# EAGLE design RSL_Satellite (EAGLE 6.4)
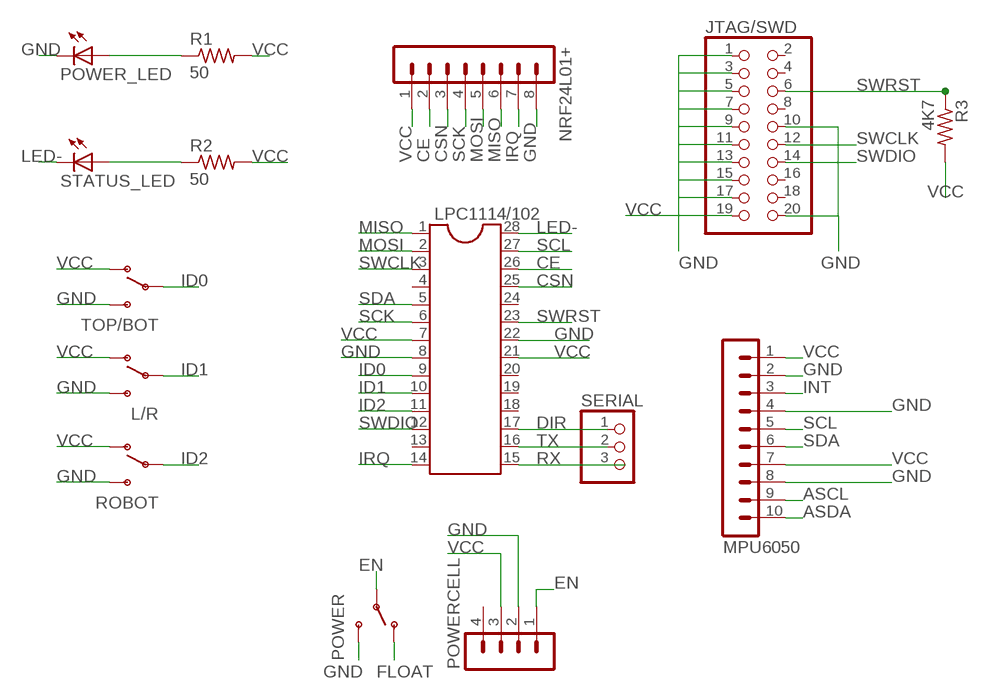
[diagram p0: schematic, sheet 1]

## Parts
JTAG/SWD  PINHD-2X10  [2X10]
L/R  SWITCH-SPDTPTH  [SWITCH-SPDT]
LPC1114/102  DIL28  [DIL28-6]
MPU6050  MA10-1  [MA10-1]
NRF24L01+  MA08-1  [MA08-1]
POWER  SWITCH-SPDTPTH  [SWITCH-SPDT]
POWER_LED  LED5MM  [LED5MM]
POWERCELL  MA04-1  [MA04-1]
R1  50  R-US_0207/10  [0207/10]
R2  50  R-US_0207/10  [0207/10]
R3  4K7  R-US_0207/10  [0207/10]
ROBOT  SWITCH-SPDTPTH  [SWITCH-SPDT]
SERIAL  PINHD-1X3  [1X03]
STATUS_LED  LED5MM  [LED5MM]
TOP/BOT  SWITCH-SPDTPTH  [SWITCH-SPDT]

## Nets
ASCL: MPU6050.9
ASDA: MPU6050.10
CE: LPC1114/102.26 NRF24L01+.2
CSN: LPC1114/102.25 NRF24L01+.3
DIR: LPC1114/102.17 SERIAL.1
EN: POWER.2(P) POWERCELL.1
FLOAT: POWER.1(O)
GND: JTAG/SWD.1 JTAG/SWD.3 JTAG/SWD.5 JTAG/SWD.7 JTAG/SWD.9 JTAG/SWD.10 JTAG/SWD.11 JTAG/SWD.13 JTAG/SWD.15 JTAG/SWD.17 JTAG/SWD.20 L/R.3(S) LPC1114/102.8 LPC1114/102.22 MPU6050.2 MPU6050.4 MPU6050.8 NRF24L01+.8 POWER.3(S) POWER_LED.K(C) POWERCELL.2 ROBOT.3(S) TOP/BOT.3(S)
ID0: LPC1114/102.9 TOP/BOT.2(P)
ID1: L/R.2(P) LPC1114/102.10
ID2: LPC1114/102.11 ROBOT.2(P)
INT: MPU6050.3
IRQ: LPC1114/102.14 NRF24L01+.7
LED-: LPC1114/102.28 STATUS_LED.K(C)
MISO: LPC1114/102.1 NRF24L01+.6
MOSI: LPC1114/102.2 NRF24L01+.5
N$1: POWER_LED.A R1.1
N$2: R2.1 STATUS_LED.A
RX: LPC1114/102.15 SERIAL.3
SCK: LPC1114/102.6 NRF24L01+.4
SCL: LPC1114/102.27 MPU6050.5
SDA: LPC1114/102.5 MPU6050.6
SWCLK: JTAG/SWD.12 LPC1114/102.3
SWDIO: JTAG/SWD.14 LPC1114/102.12
SWRST: JTAG/SWD.6 LPC1114/102.23 R3.1
TX: LPC1114/102.16 SERIAL.2
VCC: JTAG/SWD.19 L/R.1(O) LPC1114/102.7 LPC1114/102.21 MPU6050.1 MPU6050.7 NRF24L01+.1 POWERCELL.3 R1.2 R2.2 R3.2 ROBOT.1(O) TOP/BOT.1(O)
Unconnected: JTAG/SWD.2 JTAG/SWD.4 JTAG/SWD.8 JTAG/SWD.16 JTAG/SWD.18 LPC1114/102.4 LPC1114/102.13 LPC1114/102.18 LPC1114/102.19 LPC1114/102.20 LPC1114/102.24 POWERCELL.4

## Library data of the parts
JTAG/SWD = pinhead:PINHD-2X10: PIN HEADER
L/R POWER ROBOT TOP/BOT = SparkFun-Electromechanical:SWITCH-SPDT: SPDT Switch Simple slide switch, Spark Fun Electronics SKU : COM-00102 DPDT SMT slide switch, AYZ0202, SWCH-08179
LPC1114/102 = ic-package:DIL28: Dual In Line
MPU6050 = con-lstb:MA10-1: PIN HEADER
NRF24L01+ = con-lstb:MA08-1: PIN HEADER
POWER_LED STATUS_LED = led:LED: LED OSRAM: - CHIPLED LG R971, LG N971, LY N971, LG Q971, LY Q971, LO R971, LY R971 LH N974, LH R974 LS Q976, LO Q976, LY Q976 LO Q996 - Hyper CHIPLED LW Q18S LB Q993, LB Q99A, LB R99A - SideLED LS A670, LO A670, LY A670, LG A670, LP A670 LB A673, LV A673, LT A673, LW A673 LH A674 LY A675 LS A676, LA A676, LO A676, LY A676, LW A676 LS A679, LY A679, LG A679 - Hyper Micro SIDELED® LS Y876, LA Y876, LO Y876, LY Y876 LT Y87S - SmartLED LW L88C, LW L88S LB L89C, LB L89S, LG L890 LS L89K, LO L89K, LY L89K LS L896, LA L896, LO L896, LY L896 - TOPLED LS T670, LO T670, LY T670, LG T670, LP T670 LSG T670, LSP T670, LSY T670, LOP T670, LYG T670 LG T671, LOG T671, LSG T671 LB T673, LV T673, LT T673, LW T673 LH T674 LS T676, LA T676, LO T676, LY T676, LB T676, LH T676, LSB T676, LW T676 LB T67C, LV T67C, LT T67C, LS T67K, LO T67K, LY T67K, LW E67C LS E67B, LA E67B, LO E67B, LY E67B, LB E67C, LV E67C, LT E67C LW T67C LS T679, LY T679, LG T679 LS T770, LO T770, LY T770, LG T770, LP T770 LB T773, LV T773, LT T773, LW T773 LH T774 LS E675, LA E675, LY E675, LS T675 LS T776, LA T776, LO T776, LY T776, LB T776 LHGB T686 LT T68C, LB T68C - Hyper Mini TOPLED® LB M676 - Mini TOPLED Santana® LG M470 LS M47K, LO M47K, LY M47K Source: http://www.osram.convergy.de LUXEON: - LUMILED® LXK2-PW12-R00, LXK2-PW12-S00, LXK2-PW14-U00, LXK2-PW14-V00 LXK2-PM12-R00, LXK2-PM12-S00, LXK2-PM14-U00 LXK2-PE12-Q00, LXK2-PE12-R00, LXK2-PE12-S00, LXK2-PE14-T00, LXK2-PE14-U00 LXK2-PB12-K00, LXK2-PB12-L00, LXK2-PB12-M00, LXK2-PB14-N00, LXK2-PB14-P00, LXK2-PB14-Q00 LXK2-PR12-L00, LXK2-PR12-M00, LXK2-PR14-Q00, LXK2-PR14-R00 LXK2-PD12-Q00, LXK2-PD12-R00, LXK2-PD12-S00 LXK2-PH12-R00, LXK2-PH12-S00 LXK2-PL12-P00, LXK2-PL12-Q00, LXK2-PL12-R00 Source: www.luxeon.com KINGBRIGHT: KA-3528ASYC Source: www.kingbright.com
POWERCELL = con-lstb:MA04-1: PIN HEADER
R1-R3 = resistor:R-US_: RESISTOR, American symbol
SERIAL = pinhead:PINHD-1X3: PIN HEADER

## Board
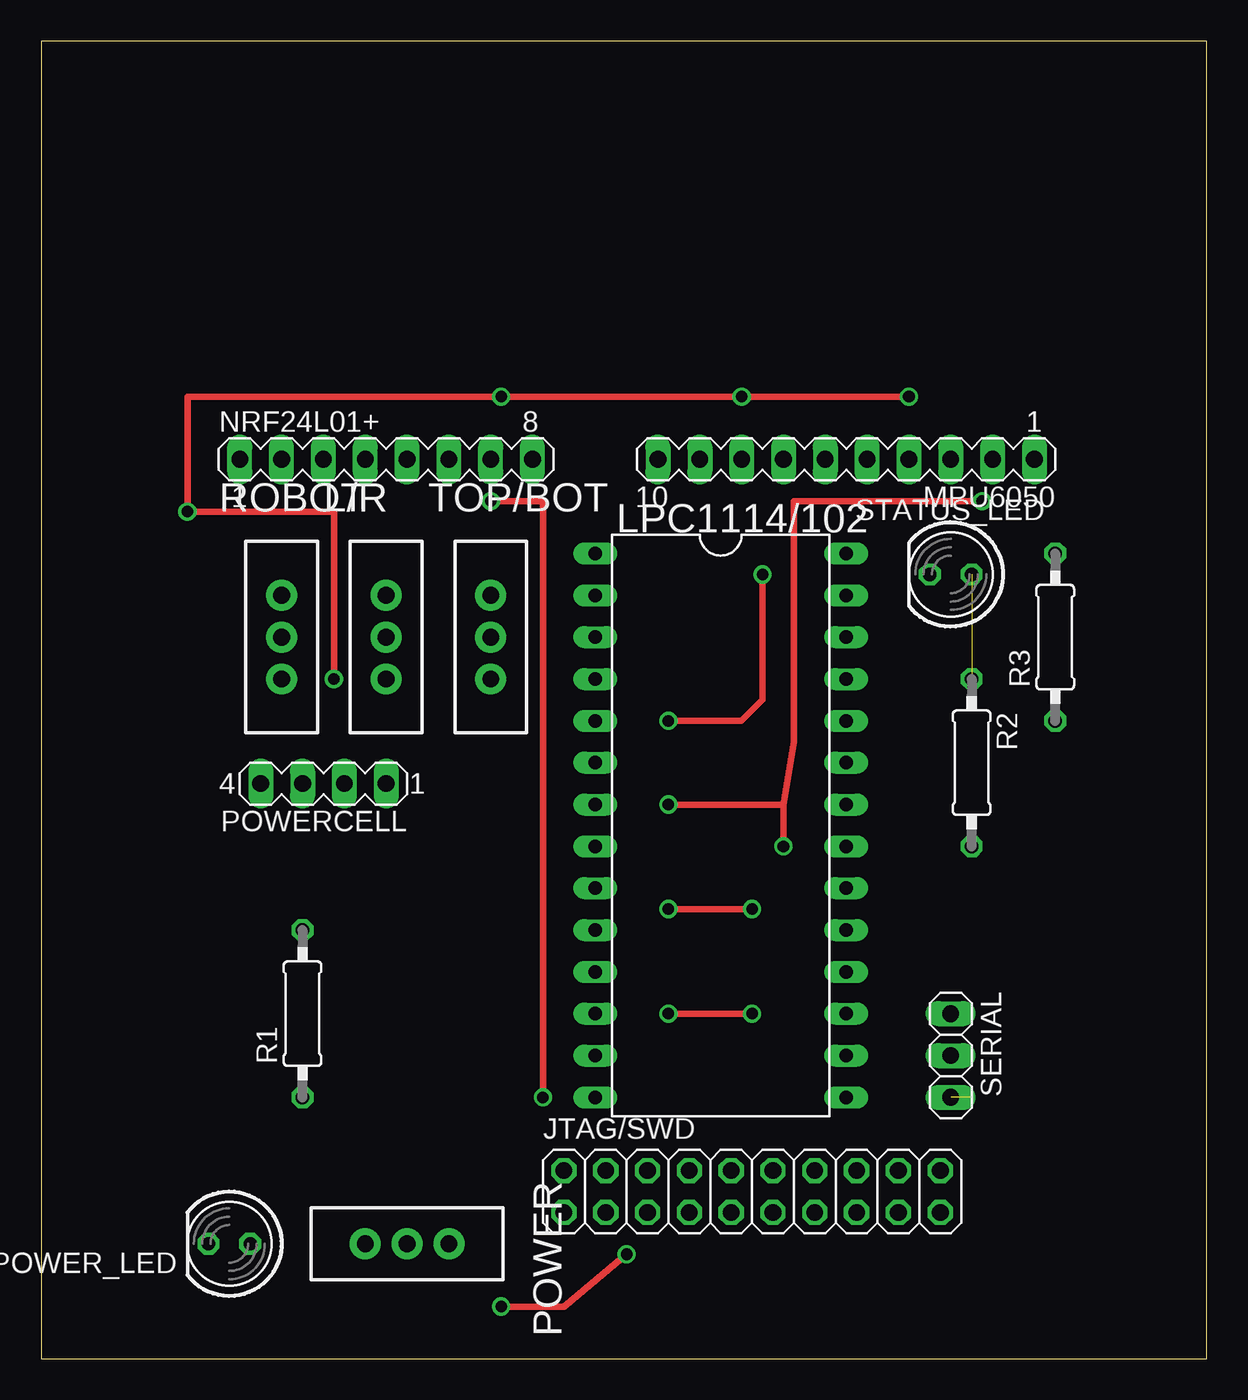
[diagram p1: board, top side]
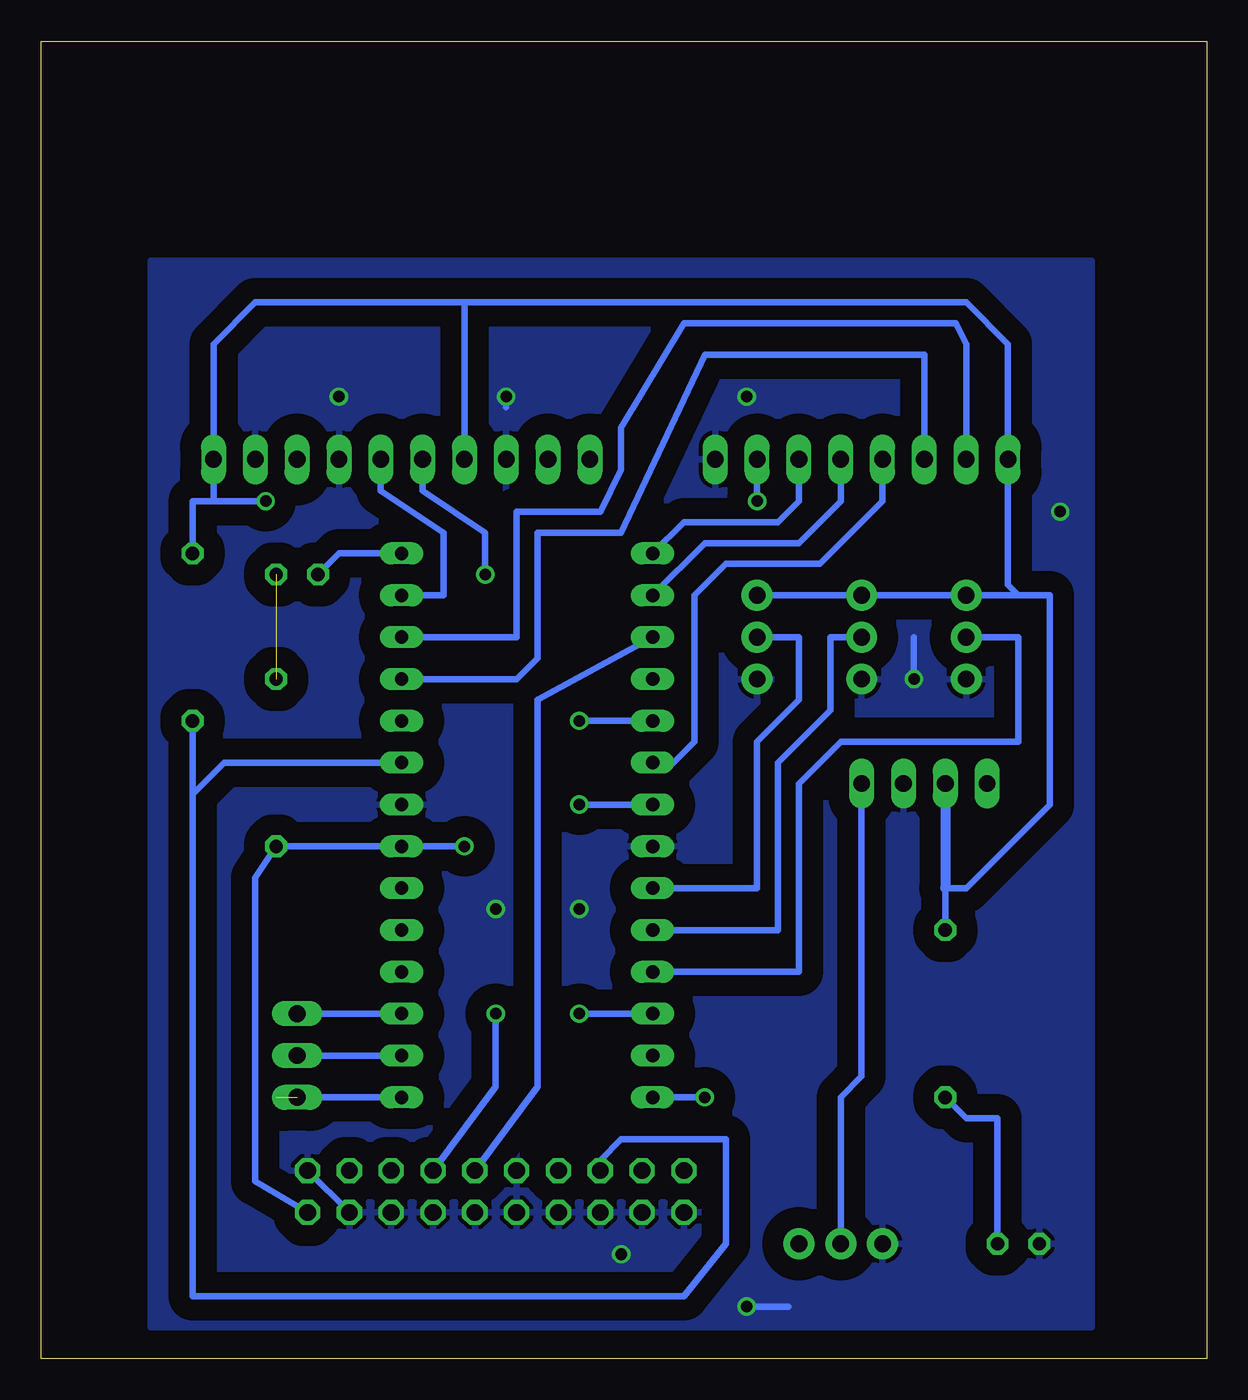
[diagram p2: board, bottom side, seen from below]

Size 70.79 x 80 mm. Coordinates in mm from the lower left corner, seen from the top.
Outline: 0,0 70.79,0 70.79,80 0,80 0,0
Copper layers (1*16): Top 0.035mm / dielectric 1.5mm / Bottom 0.035mm
Design rules "default": minimum track width 10mil, minimum drill 24mil, track to track 8mil, track to pad 8mil, pad to pad 8mil, via to via 8mil, smd to smd 8mil, copper to edge 40mil, drill to drill 8mil, minimum pad ring 10mil, minimum via ring 8mil, stop-mask expansion 4mil, vias tented up to drill 0mil, thermal gap 10mil

### Footprints (pad centres in the part's own frame; a part is rotated, then mirrored left to right if it is on the bottom)
2X10 = drill 1.016 octagon: 1 -11.43,-1.27; 2 -11.43,1.27; 3 -8.89,-1.27; 4 -8.89,1.27; 5 -6.35,-1.27; 6 -6.35,1.27; 7 -3.81,-1.27; 8 -3.81,1.27; 9 -1.27,-1.27; 10 -1.27,1.27; 11 1.27,-1.27; 12 1.27,1.27; 13 3.81,-1.27; 14 3.81,1.27; 15 6.35,-1.27; 16 6.35,1.27; 17 8.89,-1.27; 18 8.89,1.27; 19 11.43,-1.27; 20 11.43,1.27
SWITCH-SPDT = drill 1.016 pad 1.88: 1 0,2.54; 2 0,0; 3 0,-2.54
DIL28-6 = drill 0.813 long: 1 -16.51,-7.62; 2 -13.97,-7.62; 3 -11.43,-7.62; 4 -8.89,-7.62; 5 -6.35,-7.62; 6 -3.81,-7.62; 7 -1.27,-7.62; 8 1.27,-7.62; 9 3.81,-7.62; 10 6.35,-7.62; 11 8.89,-7.62; 12 11.43,-7.62; 13 13.97,-7.62; 14 16.51,-7.62; 15 16.51,7.62; 16 13.97,7.62; 17 11.43,7.62; 18 8.89,7.62; 19 6.35,7.62; 20 3.81,7.62; 21 1.27,7.62; 22 -1.27,7.62; 23 -3.81,7.62; 24 -6.35,7.62; 25 -8.89,7.62; 26 -11.43,7.62; 27 -13.97,7.62; 28 -16.51,7.62
MA10-1 = drill 1.016 long: 1 -11.43,0; 2 -8.89,0; 3 -6.35,0; 4 -3.81,0; 5 -1.27,0; 6 1.27,0; 7 3.81,0; 8 6.35,0; 9 8.89,0; 10 11.43,0
MA08-1 = drill 1.016 long: 1 -8.89,0; 2 -6.35,0; 3 -3.81,0; 4 -1.27,0; 5 1.27,0; 6 3.81,0; 7 6.35,0; 8 8.89,0
LED5MM = drill 0.813 octagon: A -1.27,0; K 1.27,0
MA04-1 = drill 1.016 long: 1 -3.81,0; 2 -1.27,0; 3 1.27,0; 4 3.81,0
0207/10 = drill 0.813 octagon: 1 -5.08,0; 2 5.08,0
1X03 = drill 1.016 long: 1 -2.54,0; 2 0,0; 3 2.54,0

### Placement (x,y rotation side)
JTAG/SWD  43.18,10.16 0 top
L/R  20.95,43.81 0 top
LPC1114/102  41.27,32.38 270 top
MPU6050  48.9,54.61 180 top
NRF24L01+  20.95,54.61 0 top
POWER  22.23,6.99 270 top
POWER_LED  11.43,6.99 180 top
POWERCELL  17.14,34.92 180 top
R1  15.88,20.95 90 top
R2  56.52,36.2 270 top
R3  61.59,43.81 90 top
ROBOT  14.61,43.81 0 top
SERIAL  55.24,18.41 270 top
STATUS_LED  55.24,47.62 180 top
TOP/BOT  27.3,43.81 0 top

### Tracks (layer width: path | path; a pad name or v marks a point on that pad's centre or on a via)
CE
  Bottom 0.406: LPC1114/102.26 41.91,43.81 41.91,51.44 36.83,51.44 35.56,53.98 35.56,56.52 31.75,62.87 15.24,62.87 14.61,61.59 NRF24L01+.2
CSN
  Bottom 0.406: LPC1114/102.25 41.91,41.27 40.64,42.55 40.64,50.16 35.56,50.16 30.48,60.96 17.14,60.96 NRF24L01+.3
DIR
  Bottom 0.406: LPC1114/102.17 SERIAL.1
EN
  Bottom 0.406: POWERCELL.1 20.95,17.14 22.23,15.88 POWER.2
GND  (via drill 0.7)
  Top 0.406: v52.7,58.42 v42.55,58.42 v27.94,58.42 8.89,58.42 v8.89,51.44 17.78,51.44 v17.78,41.27 17.78,43.81 | v35.56,6.35 31.75,3.17 v27.94,3.17 | v38.1,27.3 v43.18,27.3
  Bottom 0.406: v17.78,41.27 17.78,43.81 | v27.94,3.17 25.4,3.17 | v42.55,58.42 42.55,57.78 | JTAG/SWD.17 JTAG/SWD.20
  pour Bottom (isolate 1.27): 6.99,66.67 64.14,66.67 64.14,1.91 6.99,1.91
ID0
  Bottom 0.406: 26.67,43.81 TOP/BOT.2 24.77,43.81 24.77,40.01 27.3,37.47 27.3,28.57 LPC1114/102.9
ID1
  Bottom 0.406: 21.59,43.81 L/R.2 22.86,43.81 22.86,39.37 26.04,36.2 26.04,26.04 LPC1114/102.10
ID2
  Bottom 0.406: ROBOT.2 11.43,43.81 11.43,37.47 22.23,37.47 24.77,34.92 24.77,23.5 LPC1114/102.11
IRQ  (via drill 0.7)
  Top 0.406: v27.3,52.07 30.48,52.07 v30.48,15.88
  Bottom 0.406: v30.48,15.88 LPC1114/102.14 | v27.3,52.07 NRF24L01+.7
LED-
  Bottom 0.406: LPC1114/102.28 52.7,48.9 STATUS_LED.K
MISO
  Bottom 0.406: LPC1114/102.1 31.75,50.8 26.04,50.8 24.77,52.07 NRF24L01+.6
MOSI
  Bottom 0.406: LPC1114/102.2 30.48,49.53 24.77,49.53 22.23,52.07 NRF24L01+.5
N$1
  Bottom 0.406: POWER_LED.A 12.7,14.61 14.61,14.61 R1.1
N$2  (1 unrouted)
RX  (1 unrouted)
  Bottom 0.406: LPC1114/102.15 56.52,15.88
SCK
  Bottom 0.406: LPC1114/102.6 32.38,36.2 31.11,37.47 31.11,46.35 29.21,48.26 23.5,48.26 19.68,52.07 NRF24L01+.4
SCL
  Bottom 0.406: LPC1114/102.27 46.35,46.35 46.35,50.16 50.16,52.7 MPU6050.5
SDA  (via drill 0.7)
  Top 0.406: v38.1,38.73 42.55,38.73 43.81,40.01 v43.81,47.62
  Bottom 0.406: LPC1114/102.5 v38.1,38.73 | v43.81,47.62 43.81,50.16 47.62,52.7 MPU6050.6
SWCLK
  Bottom 0.406: LPC1114/102.3 40.64,40.01 40.64,16.51 JTAG/SWD.12
SWDIO  (via drill 0.7)
  Top 0.406: v43.18,20.95 v38.1,20.95
  Bottom 0.406: v43.18,20.95 43.18,16.51 JTAG/SWD.14 | v38.1,20.95 LPC1114/102.12
SWRST
  Bottom 0.406: LPC1114/102.23 59.69,36.2 61.59,34.29 | R3.1 61.59,34.29 | 61.59,34.29 61.59,3.81 31.75,3.81 29.21,6.99 29.21,13.34 35.56,13.34 36.83,12.06 JTAG/SWD.6
TX
  Bottom 0.406: LPC1114/102.16 SERIAL.2
VCC  (via drill 0.7)
  Top 0.406: v38.1,33.66 45.09,33.66 | 45.09,33.66 45.72,37.47 45.72,52.07 v57.15,52.07 | 45.09,33.66 v45.09,31.11
  Bottom 0.406: 11.43,46.35 9.53,46.35 9.53,33.66 14.61,28.57 15.88,28.57 R1.2 | 11.43,46.35 ROBOT.1 L/R.1 TOP/BOT.1 | 45.09,64.14 14.61,64.14 12.06,61.59 NRF24L01+.1 12.06,46.99 11.43,46.35 | 45.09,64.14 57.78,64.14 60.33,61.59 MPU6050.1 60.33,52.07 | v45.09,31.11 LPC1114/102.21 R2.2 57.78,29.21 57.78,10.79 JTAG/SWD.19 | LPC1114/102.7 v38.1,33.66 | 60.33,52.07 61.59,52.07 R3.2 | 60.33,52.07 v57.15,52.07 | 45.09,64.14 MPU6050.7
  Bottom 0.61: POWERCELL.3 15.88,28.57